# Altium schematic sheet Overview.SchDoc
size A4; SheetNumber: 1; SheetTotal: 7
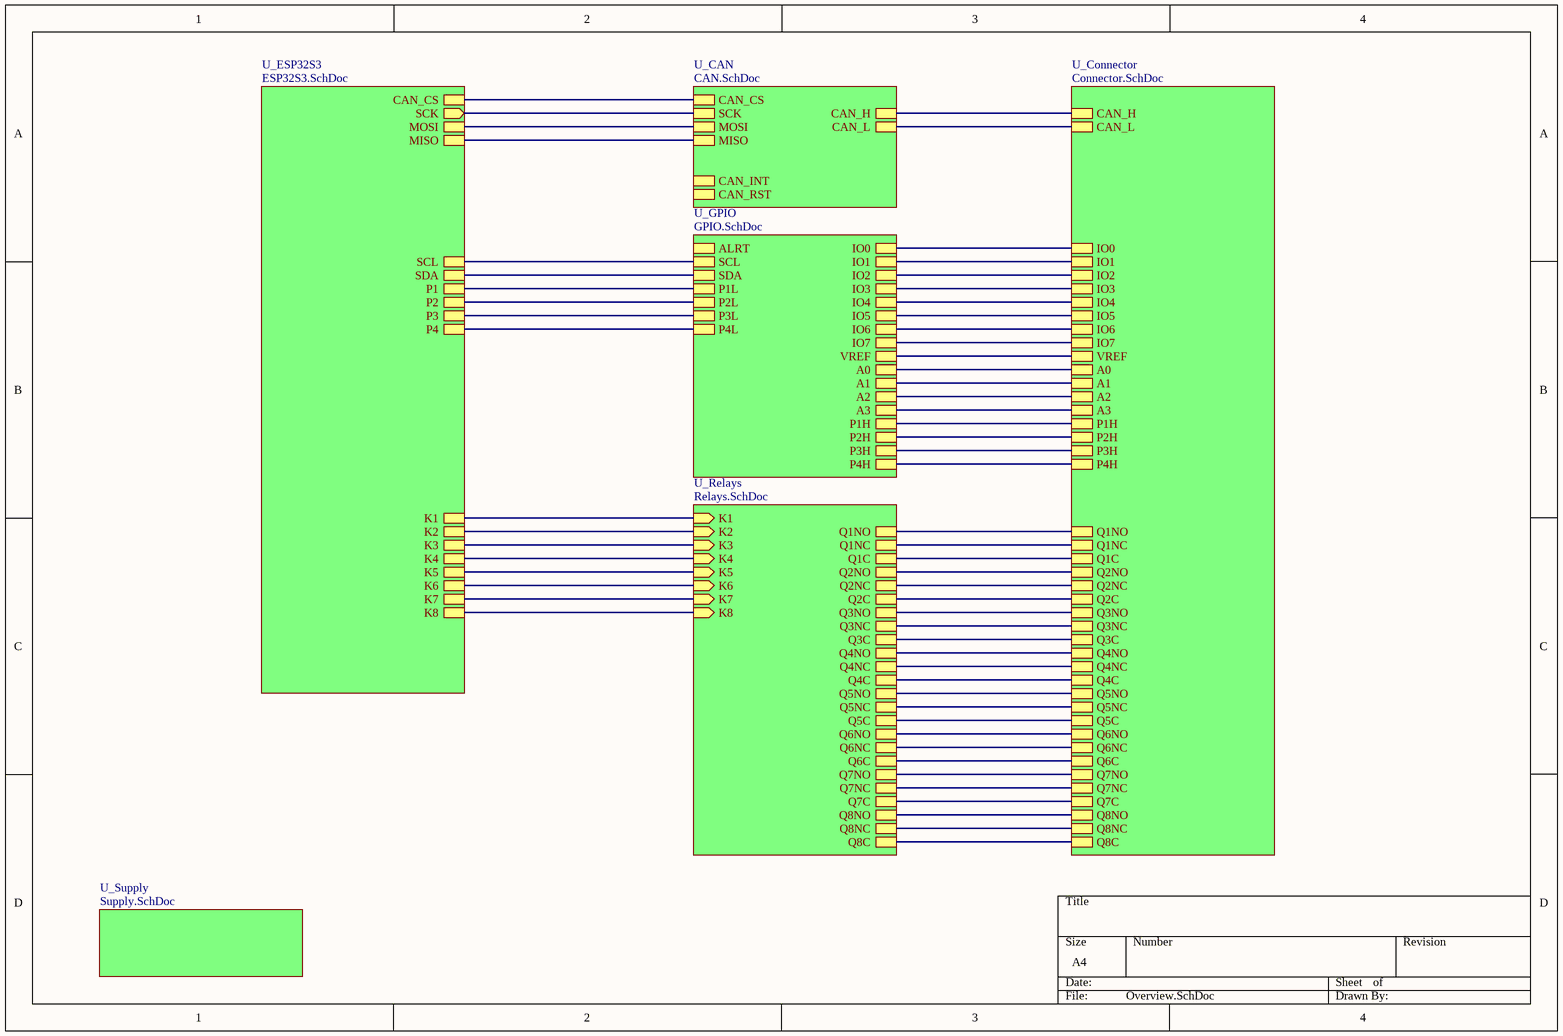
[diagram p0: Overview.SchDoc]

## Sub-sheets
U_CAN = CAN.SchDoc: CAN_CS, SCK, MOSI, MISO, CAN_H, CAN_L, CAN_INT, CAN_RST
U_Connector = Connector.SchDoc: Q1NO, Q1NC, Q1C, Q2NO, Q2NC, Q2C, Q3NO, Q3NC, Q3C, Q4NO, Q4NC, Q4C, Q5NO, Q5NC, Q5C, Q6NO, Q6NC, Q6C, Q7NO, Q7NC, Q7C, Q8NO, Q8NC, Q8C, CAN_H, CAN_L, IO0, IO1, IO2, IO3, IO4, IO5, IO6, IO7, VREF, A0, A1, A2, A3, P1H, P2H, P3H, P4H
U_ESP32S3 = ESP32S3.SchDoc: SCK (out), MISO, MOSI, CAN_CS, P1, P2, P3, P4, K1, K2, K3, K4, K5, K6, K7, K8, SDA, SCL
U_GPIO = GPIO.SchDoc: ALRT, SCL, SDA, A0, A1, A2, A3, IO0, IO1, IO2, IO3, IO4, IO5, IO6, IO7, VREF, P1L, P3L, P4L, P2L, P1H, P2H, P3H, P4H
U_Relays = Relays.SchDoc: K1 (in), K2 (in), K3 (in), K4 (in), K5 (in), K6 (in), K7 (in), K8 (in), Q1NO, Q1NC, Q1C, Q2NO, Q2NC, Q2C, Q3NO, Q3NC, Q3C, Q4NO, Q4NC, Q4C, Q5NO, Q5NC, Q5C, Q6NO, Q6NC, Q6C, Q7NO, Q7NC, Q7C, Q8NO, Q8NC, Q8C
U_Supply = Supply.SchDoc: no entries

## Nets
(unnamed): sheet U_ESP32S3/SCK, sheet U_CAN/SCK
(unnamed): sheet U_ESP32S3/MISO, sheet U_CAN/MISO
(unnamed): sheet U_ESP32S3/MOSI, sheet U_CAN/MOSI
(unnamed): sheet U_ESP32S3/CAN_CS, sheet U_CAN/CAN_CS
(unnamed): sheet U_ESP32S3/P1, sheet U_GPIO/P1L
(unnamed): sheet U_ESP32S3/P2, sheet U_GPIO/P2L
(unnamed): sheet U_ESP32S3/P3, sheet U_GPIO/P3L
(unnamed): sheet U_ESP32S3/P4, sheet U_GPIO/P4L
(unnamed): sheet U_ESP32S3/K1, sheet U_Relays/K1
(unnamed): sheet U_ESP32S3/K2, sheet U_Relays/K2
(unnamed): sheet U_ESP32S3/K3, sheet U_Relays/K3
(unnamed): sheet U_ESP32S3/K4, sheet U_Relays/K4
(unnamed): sheet U_ESP32S3/K5, sheet U_Relays/K5
(unnamed): sheet U_ESP32S3/K6, sheet U_Relays/K6
(unnamed): sheet U_ESP32S3/K7, sheet U_Relays/K7
(unnamed): sheet U_ESP32S3/K8, sheet U_Relays/K8
(unnamed): sheet U_ESP32S3/SDA, sheet U_GPIO/SDA
(unnamed): sheet U_ESP32S3/SCL, sheet U_GPIO/SCL
(unnamed): sheet U_CAN/CAN_H, sheet U_Connector/CAN_H
(unnamed): sheet U_CAN/CAN_L, sheet U_Connector/CAN_L
(unnamed): sheet U_Relays/Q1NO, sheet U_Connector/Q1NO
(unnamed): sheet U_Relays/Q1NC, sheet U_Connector/Q1NC
(unnamed): sheet U_Relays/Q1C, sheet U_Connector/Q1C
(unnamed): sheet U_Relays/Q2NO, sheet U_Connector/Q2NO
(unnamed): sheet U_Relays/Q2NC, sheet U_Connector/Q2NC
(unnamed): sheet U_Relays/Q2C, sheet U_Connector/Q2C
(unnamed): sheet U_Relays/Q3NO, sheet U_Connector/Q3NO
(unnamed): sheet U_Relays/Q3NC, sheet U_Connector/Q3NC
(unnamed): sheet U_Relays/Q3C, sheet U_Connector/Q3C
(unnamed): sheet U_Relays/Q4NO, sheet U_Connector/Q4NO
(unnamed): sheet U_Relays/Q4NC, sheet U_Connector/Q4NC
(unnamed): sheet U_Relays/Q4C, sheet U_Connector/Q4C
(unnamed): sheet U_Relays/Q5NO, sheet U_Connector/Q5NO
(unnamed): sheet U_Relays/Q5NC, sheet U_Connector/Q5NC
(unnamed): sheet U_Relays/Q5C, sheet U_Connector/Q5C
(unnamed): sheet U_Relays/Q6NO, sheet U_Connector/Q6NO
(unnamed): sheet U_Relays/Q6NC, sheet U_Connector/Q6NC
(unnamed): sheet U_Relays/Q6C, sheet U_Connector/Q6C
(unnamed): sheet U_Relays/Q7NO, sheet U_Connector/Q7NO
(unnamed): sheet U_Relays/Q7NC, sheet U_Connector/Q7NC
(unnamed): sheet U_Relays/Q7C, sheet U_Connector/Q7C
(unnamed): sheet U_Relays/Q8NO, sheet U_Connector/Q8NO
(unnamed): sheet U_Relays/Q8NC, sheet U_Connector/Q8NC
(unnamed): sheet U_Relays/Q8C, sheet U_Connector/Q8C
(unnamed): sheet U_GPIO/A0, sheet U_Connector/A0
(unnamed): sheet U_GPIO/A1, sheet U_Connector/A1
(unnamed): sheet U_GPIO/A2, sheet U_Connector/A2
(unnamed): sheet U_GPIO/A3, sheet U_Connector/A3
(unnamed): sheet U_GPIO/IO0, sheet U_Connector/IO0
(unnamed): sheet U_GPIO/IO1, sheet U_Connector/IO1
(unnamed): sheet U_GPIO/IO2, sheet U_Connector/IO2
(unnamed): sheet U_GPIO/IO3, sheet U_Connector/IO3
(unnamed): sheet U_GPIO/IO4, sheet U_Connector/IO4
(unnamed): sheet U_GPIO/IO5, sheet U_Connector/IO5
(unnamed): sheet U_GPIO/IO6, sheet U_Connector/IO6
(unnamed): sheet U_GPIO/IO7, sheet U_Connector/IO7
(unnamed): sheet U_GPIO/VREF, sheet U_Connector/VREF
(unnamed): sheet U_GPIO/P1H, sheet U_Connector/P1H
(unnamed): sheet U_GPIO/P2H, sheet U_Connector/P2H
(unnamed): sheet U_GPIO/P3H, sheet U_Connector/P3H
(unnamed): sheet U_GPIO/P4H, sheet U_Connector/P4H